# Altium schematic sheet Revision History.SchDoc: Revision History
size A4; Organization: Minbiocabanon Corp.; Address2: Kiwi road; Address3: TOULOUSE; Address4: FRANCE; DocumentNumber: 3; SheetNumber: 3; SheetTotal: 5
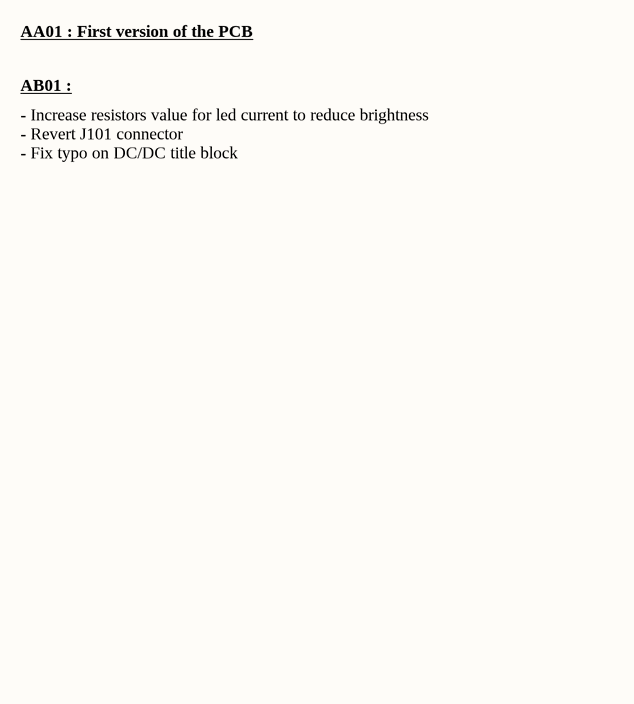
[diagram p0: Revision History.SchDoc]

## Notes on the sheet
- AA01 : First version of the PCB
- AB01 :
- - Increase resistors value for led current to reduce brightness
  - Revert J101 connector
  - Fix typo on DC/DC title block
- CLOCKS (CPU & PCIE)
- Projet:
- Title:
- Size:
- Date:
- A4
- PN:
- Revision:
- Page
- of
- Confidentiel - Les informations contenues dans ce document et tous les fichiers éventuellement attachés sont confidentiels.